# EAGLE design MOD-IO2_Rev_B (EAGLE 6.4)
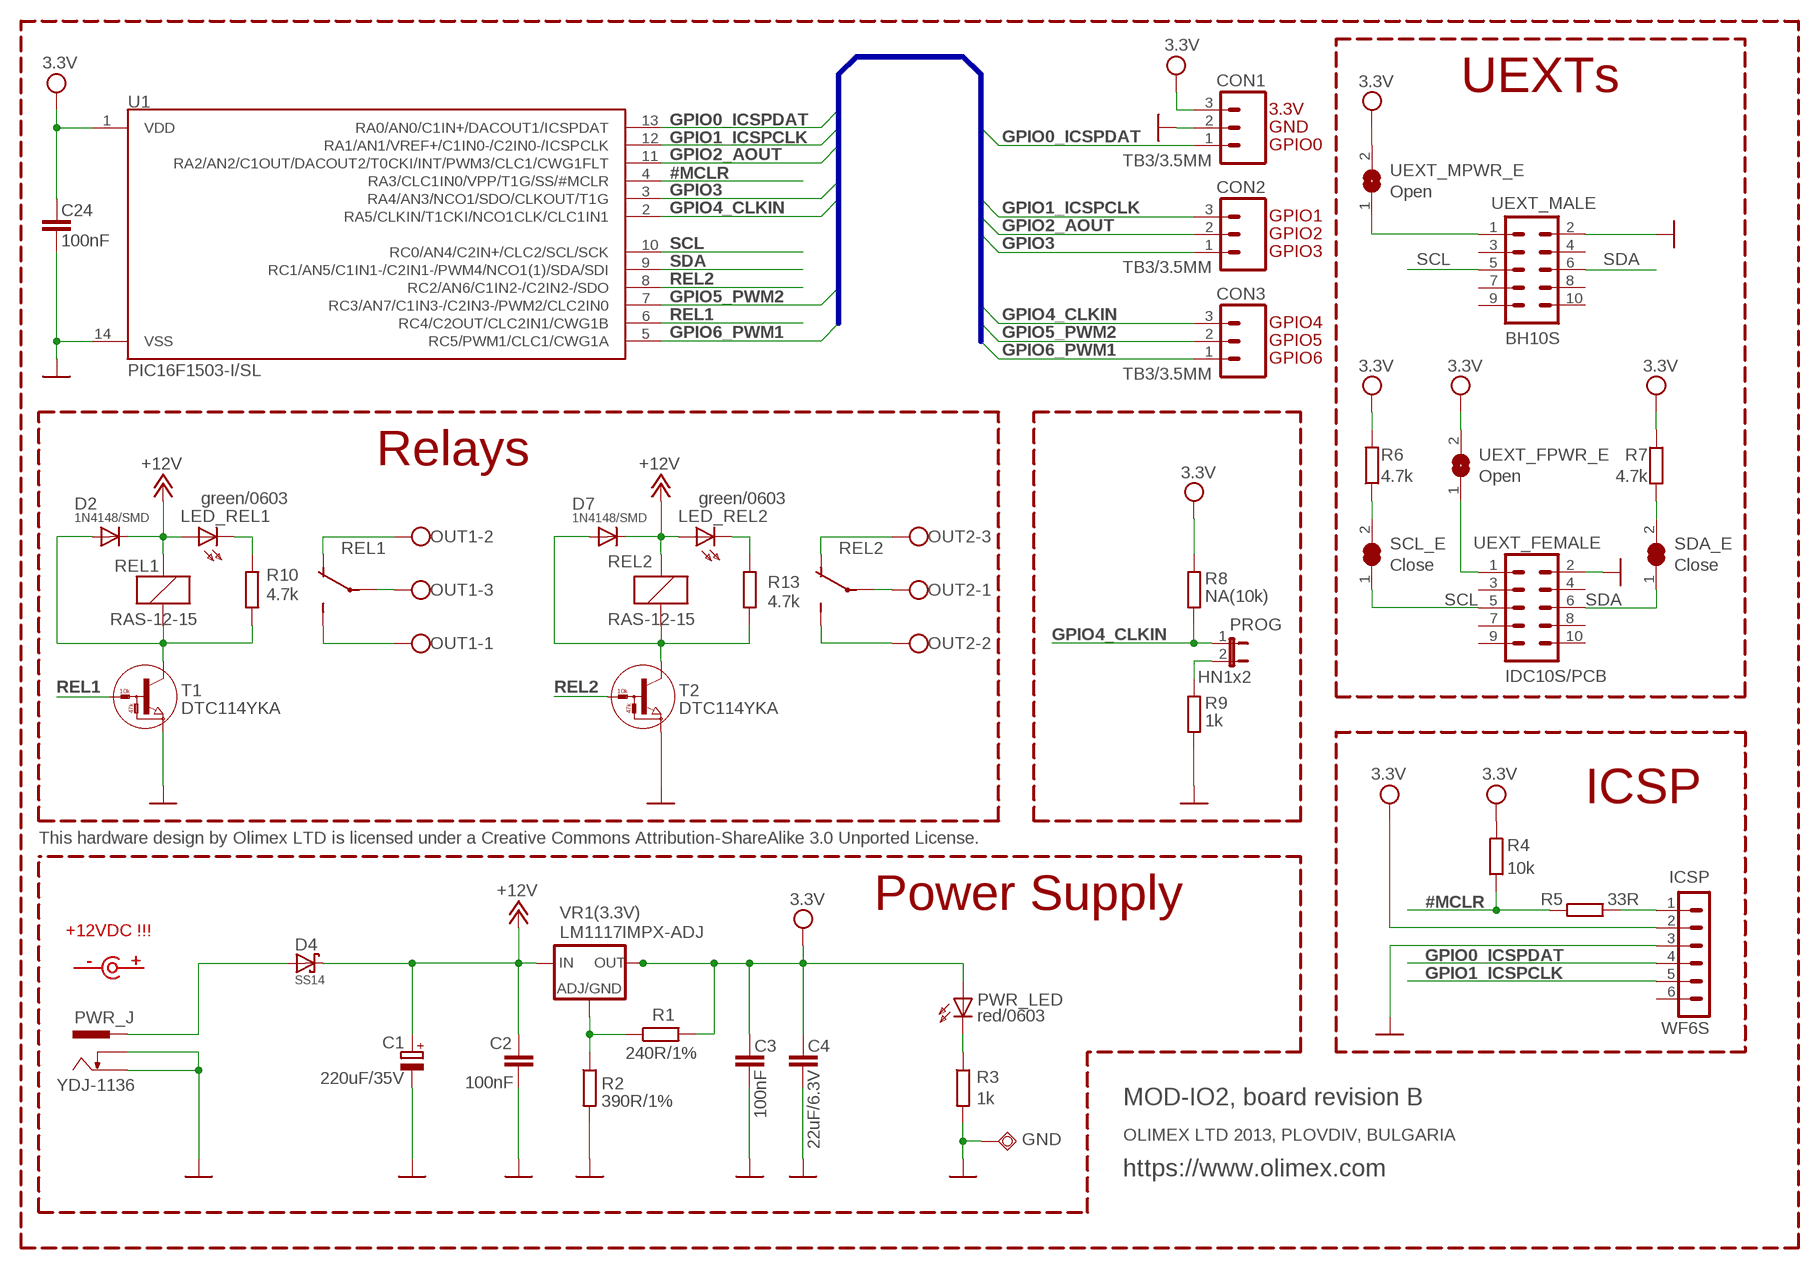
[diagram p0: schematic, sheet 1]

## Parts
C1  220uF/35V  CPOL-EUE3.5-8  [E3,5-8]
C2  100nF  C-EUC0603_5MIL  [C0603_5MIL]
C3  100nF  C-EUC0603_5MIL  [C0603_5MIL]
C4  22uF/6.3V  C-EUC0805_5MIL  [C0805_5MIL]
C24  100nF  C-EUC0603_5MIL  [C0603_5MIL]
CON1  TB3/3.5MM  CON33.5MM  [CON3/3.5MM]
CON2  TB3/3.5MM  CON33.5MM  [CON3/3.5MM]
CON3  TB3/3.5MM  CON33.5MM  [CON3/3.5MM]
D2  1N4148/SMD  DIODE-SOD80C  [SOD80C]
D4  SS14  SCHOTKKY7.62SS2  [MLL-41]
D7  1N4148/SMD  DIODE-SOD80C  [SOD80C]
GND  TESTPAD40/70  [TESTPAD]
ICSP  WF6S  CON6WF6S  [WF6S]
LED_REL1  green/0603  LED0603DWS  [LED-0603]
LED_REL2  green/0603  LED0603DWS  [LED-0603]
OUT1  TB3/5MM  W237-103  [W237-103]
OUT2  TB3/5MM  W237-103  [W237-103]
PROG  HN1x2  JP1E  [JP1]
PWR_J  YDJ-1136  PWR-JAKPWR_JACK_UNI_MILLING  [PWR_JACK_UNI_MILLING]
PWR_LED  red/0603  LED0603DWS  [LED-0603]
R1  240R/1%  R-EU_R0603_5MIL  [R0603_5MIL]
R2  390R/1%  R-EU_R0603_5MIL  [R0603_5MIL]
R3  1k  R-EU_R0603_5MIL  [R0603_5MIL]
R4  10k  R-EU_R0603_5MIL  [R0603_5MIL]
R5  33R  R-EU_R0603_5MIL  [R0603_5MIL]
R6  4.7k  R-EU_R0603_5MIL  [R0603_5MIL]
R7  4.7k  R-EU_R0603_5MIL  [R0603_5MIL]
R8  NA(10k)  R-EU_R0603_5MIL  [R0603_5MIL]
R9  1k  R-EU_R0603_5MIL  [R0603_5MIL]
R10  4.7k  R-EU_R0603_5MIL  [R0603_5MIL]
R13  4.7k  R-EU_R0603_5MIL  [R0603_5MIL]
REL1  RAS-12-15  RELAYH200F  [H200-FAT]
REL2  RAS-12-15  RELAYH200F  [H200-FAT]
SCL_E  Close  SJSJ-CLOSE  [SJ-CLOSE]
SDA_E  Close  SJSJ-CLOSE  [SJ-CLOSE]
T1  DTC114YKA  DIGITAL_TRANSISTORS-NPNDTC114YKA  [SOT-23]
T2  DTC114YKA  DIGITAL_TRANSISTORS-NPNDTC114YKA  [SOT-23]
U1  PIC16F1503-I/SL  PIC16F1503  [SOIC14]
UEXT_FEMALE  IDC10S/PCB  ML10SMD_1  [ML10L_PADS_FEMAIL]
UEXT_FPWR_E  Open  SJ  [SJ]
UEXT_MALE  BH10S  ML10SMD  [ML10_PADS]
UEXT_MPWR_E  Open  SJ  [SJ]
VR1(3.3V)  LM1117IMPX-ADJ  LM1117  [SOT223]

## Nets
#MCLR: R4.2 R5.2 U1.4(RA3/CLC1IN0/VPP/T1G/SS/#MCLR)
+12V: C1.+ C2.2 D2.C D4.K(C) D7.C LED_REL1.A LED_REL2.A REL1.1 REL2.1 VR1(3.3V).3(IN)
ADJ/GND: R1.1 R2.1 VR1(3.3V).1(ADJ/GND)
GND [PWR]: C1.- C2.1 C3.1 C4.1 C24.2 CON1.2 GND.P$1(PP) ICSP.3 PWR_J.- PWR_J.-- R2.2 R3.2 R9.1 T1.2(E) T2.2(E) U1.14(VSS) UEXT_FEMALE.2 UEXT_MALE.2
GPIO0_ICSPDAT: CON1.1 ICSP.4 U1.13(RA0/AN0/C1IN+/DACOUT1/ICSPDAT)
GPIO1_ICSPCLK: CON2.3 ICSP.5 U1.12(RA1/AN1/VREF+/C1IN0-/C2IN0-/ICSPCLK)
GPIO2_AOUT: CON2.2 U1.11(RA2/AN2/C1OUT/DACOUT2/T0CKI/INT/PWM3/CLC1/CWG1FLT)
GPIO3: CON2.1 U1.3(RA4/AN3/NCO1/SDO/CLKOUT/T1G)
GPIO4_CLKIN: CON3.3 PROG.1 R8.1 U1.2(RA5/CLKIN/T1CKI/NCO1CLK/CLC1IN1)
GPIO5_PWM2: CON3.2 U1.7(RC3/AN7/C1IN3-/C2IN3-/PWM2/CLC2IN0)
GPIO6_PWM1: CON3.1 U1.5(RC5/PWM1/CLC1/CWG1A)
N$1 [rel]: OUT1.3 REL1.P(CONTACTS:P)
N$2 [PWR]: UEXT_FEMALE.1 UEXT_FPWR_E.1
N$3 [rel]: OUT2.1 REL2.P(CONTACTS:P)
N$4 [rel]: OUT2.2 REL2.S(CONTACTS:S)
N$5: R7.1 SDA_E.2
N$6: R6.1 SCL_E.2
N$7 [rel]: OUT1.1 REL1.S(CONTACTS:S)
N$9: PROG.2 R9.2
N$12 [PWR]: UEXT_MALE.1 UEXT_MPWR_E.1
N$15: ICSP.1 R5.1
N$29 [rel]: OUT2.3 REL2.O(CONTACTS:O)
N$33: LED_REL1.C R10.2
N$37 [rel]: OUT1.2 REL1.O(CONTACTS:O)
N$40: LED_REL2.C R13.2
N$43 [pwr2]: D7.A R13.1 REL2.2 T2.3(C)
N$44 [pwr2]: D2.A R10.1 REL1.2 T1.3(C)
N$50: D4.A PWR_J.+
N$59: PWR_LED.C R3.1
REL1: T1.1(B) U1.6(RC4/C2OUT/CLC2IN1/CWG1B)
REL2: T2.1(B) U1.8(RC2/AN6/C1IN2-/C2IN2-/SDO)
SCL: SCL_E.1 U1.10(RC0/AN4/C2IN+/CLC2/SCL/SCK) UEXT_FEMALE.5 UEXT_MALE.5
SDA: SDA_E.1 U1.9(RC1/AN5/C1IN1-/C2IN1-/PWM4/NCO1(1)/SDA/SDI) UEXT_FEMALE.6 UEXT_MALE.6
VCC [PWR]: C3.2 C4.2 C24.1 CON1.3 ICSP.2 PWR_LED.A R1.2 R4.1 R6.2 R7.2 R8.2 U1.1(VDD) UEXT_FPWR_E.2 UEXT_MPWR_E.2 VR1(3.3V).2(OUT) VR1(3.3V).4(RAD) ; supply symbol labelled 3.3V
Unconnected: ICSP.6 UEXT_FEMALE.3 UEXT_FEMALE.4 UEXT_FEMALE.7 UEXT_FEMALE.8 UEXT_FEMALE.9 UEXT_FEMALE.10 UEXT_MALE.3 UEXT_MALE.4 UEXT_MALE.7 UEXT_MALE.8 UEXT_MALE.9 UEXT_MALE.10

## Buses
GPIO0_ICSPDAT,GPIO1_ICSPCLK,GPIO2_AOUT,GPIO3,GPIO4_CLKIN,GPIO5_PWM2,GPIO6_PWM1

## Notes on the sheet
- UEXTs
- 3.3V
- GND
- GPIO0
- GPIO1
- GPIO2
- GPIO3
- GPIO4
- GPIO5
- GPIO6
- Relays
- ICSP
- This hardware design by Olimex LTD is licensed under a Creative Commons Attribution-ShareAlike 3.0 Unported License.
- Power Supply
- +12VDC !!!
- - | +
- MOD-IO2, board revision B
- OLIMEX LTD 2013, PLOVDIV, BULGARIA
- https://www.olimex.com

## Library data of the parts
C1 = rcl:CPOL-EU: POLARIZED CAPACITOR, European symbol
C2-C4 C24 = rcl:C-EU: CAPACITOR, European symbol
CON1-CON3 = DOUBLE-SIDE:CON3: CONNECTORS - 3 PINS
D2 D7 = diode:DIODE-: DIODE
D4 = gogo:SCHOTKKY7.62SS
GND = gogo:TESTPAD: drill 40mils, diameter 70mils
ICSP = Penko:CON6: CONNECTORS - 6 PINS
LED_REL1 LED_REL2 PWR_LED = DOUBLE-SIDE:LED
OUT1 OUT2 = con-wago-500:W237-103: WAGO SCREW CLAMP
PROG = jumper:JP1E: JUMPER
PWR_J = gogo:PWR-JAK
R1-R10 R13 = rcl:R-EU_: RESISTOR, European symbol
REL1 REL2 = SINGLE-SIDE:RELAY: RELAY
SCL_E SDA_E UEXT_FPWR_E UEXT_MPWR_E = jumper:SJ: SMD solder JUMPER
T1 T2 = OLIMEX_DISCRET:DIGITAL_TRANSISTORS-NPN: DTC114YKA Digital Transistor - NPN
U1 = OLIMEX_IC:PIC16F1503
UEXT_FEMALE UEXT_MALE = con-harting-ml:ML10: HARTING
VR1(3.3V) = arm:LM1117

## Net classes
1 PWR: width 0.203 mm, drill 0.4 mm, clearance 0.076 mm
2 pwr2: width 0.508 mm
3 rel: width 2.54 mm, clearance 1.905 mm

## Board
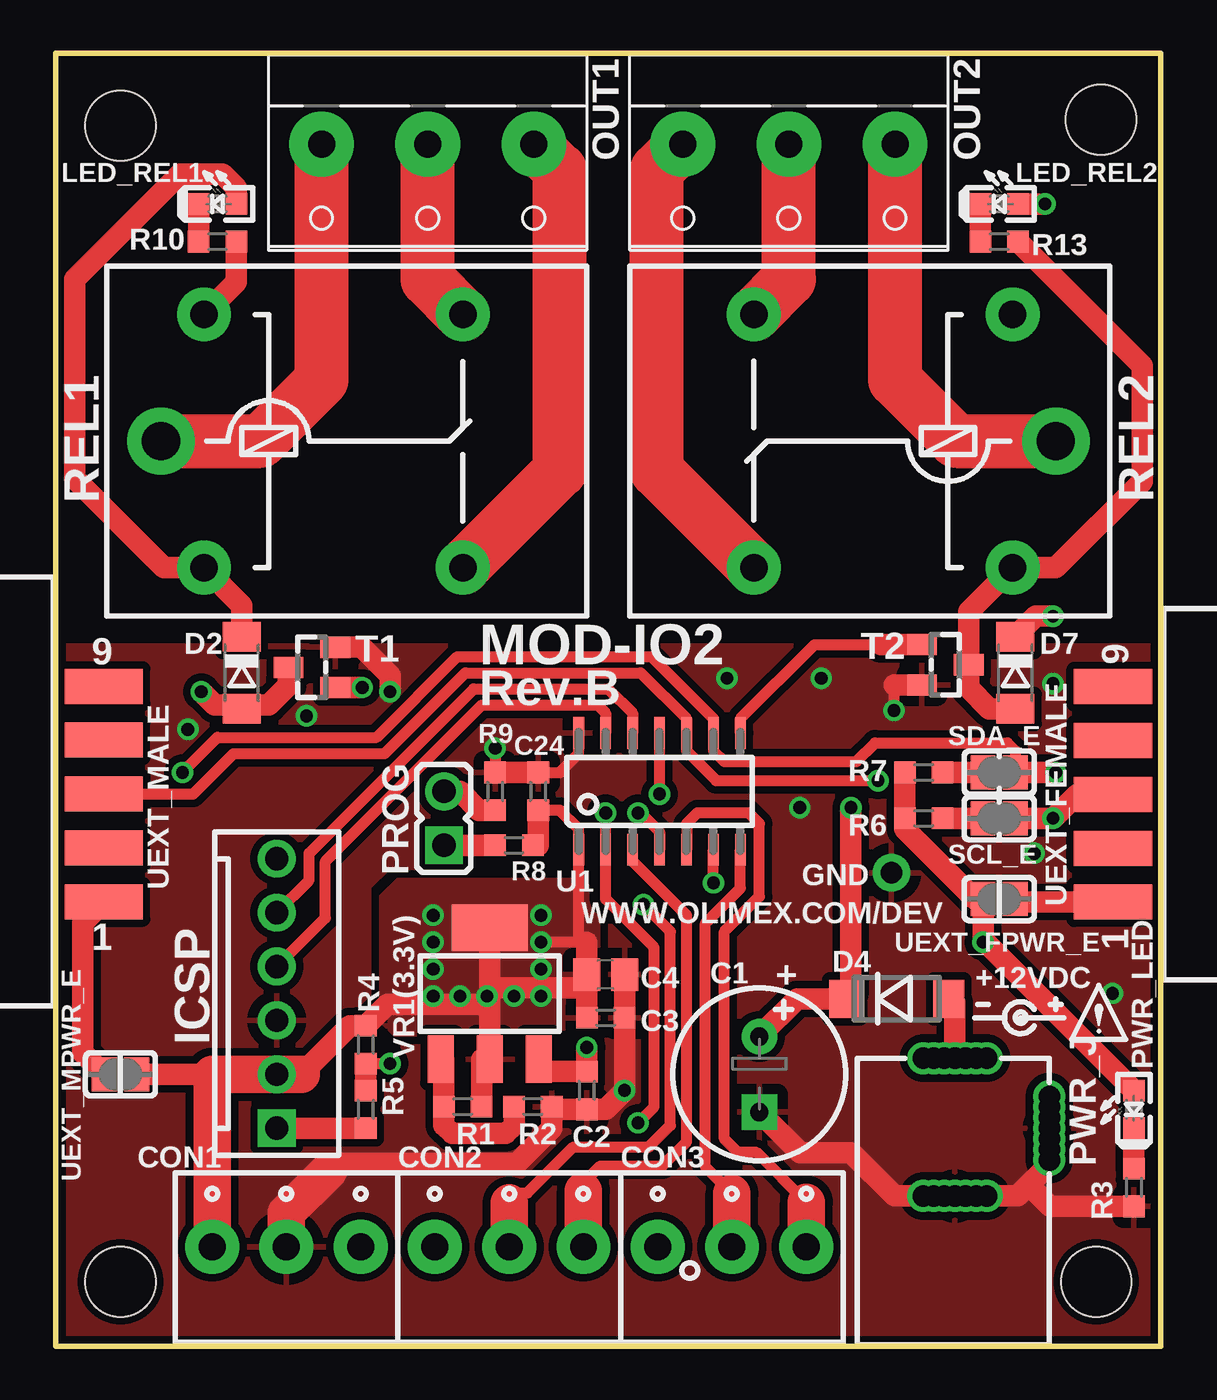
[diagram p1: board, top side]
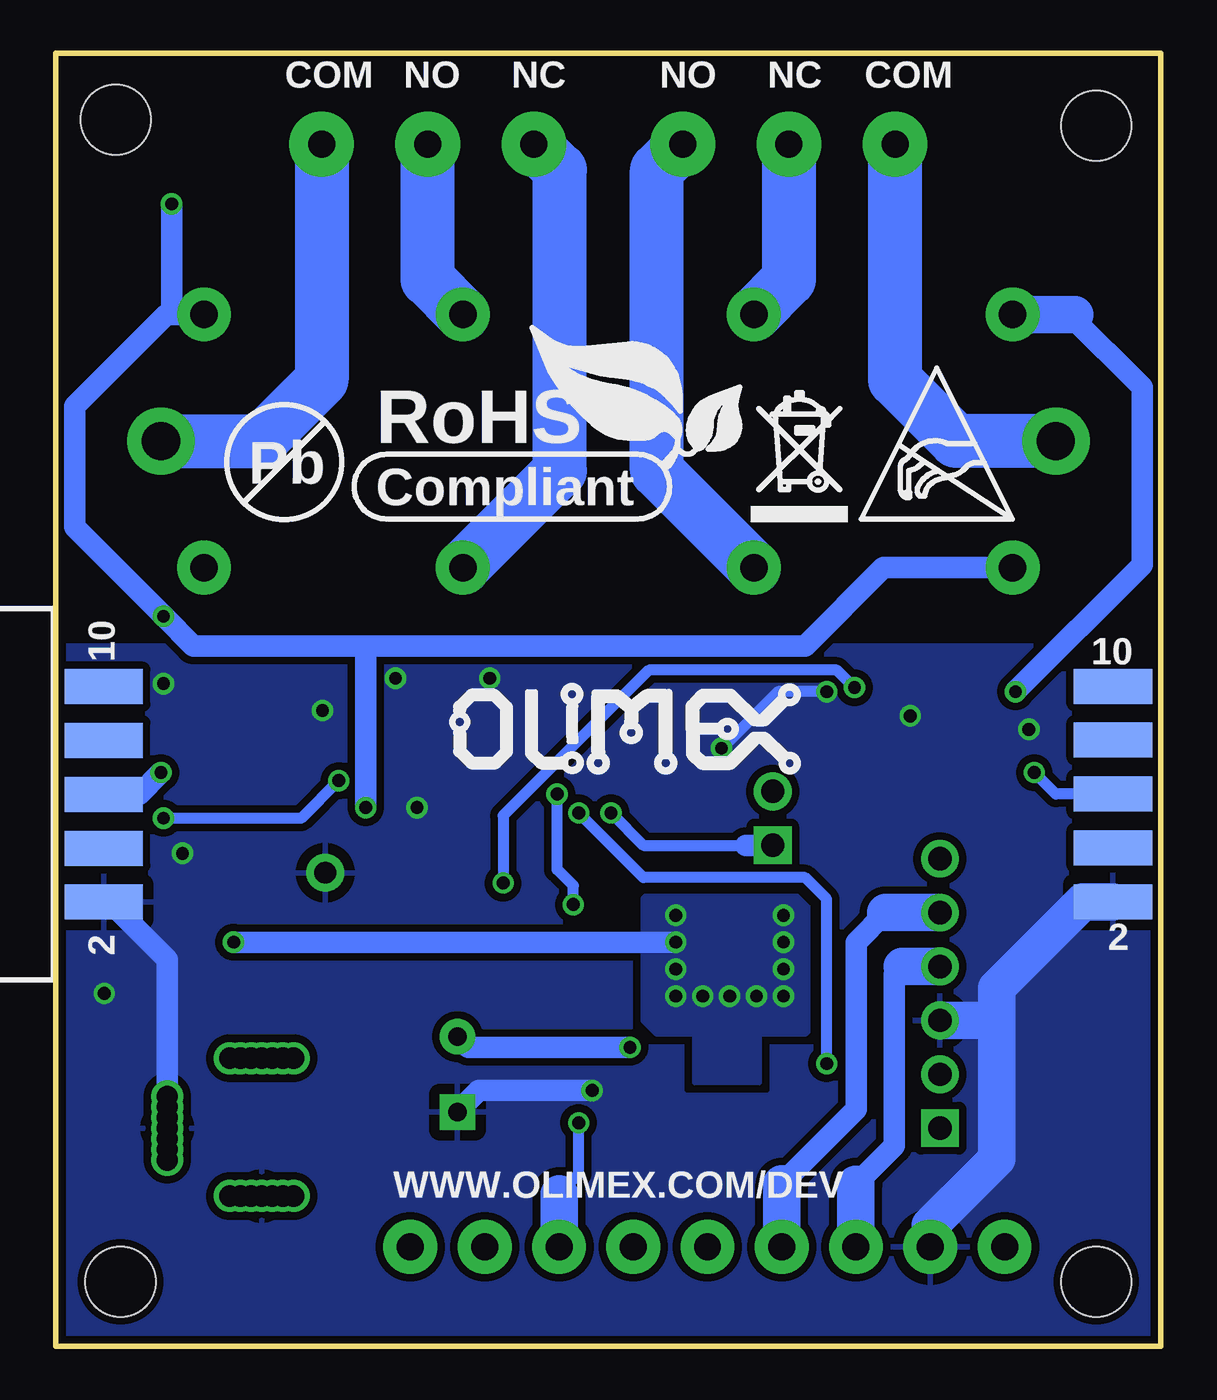
[diagram p2: board, bottom side, seen from below]

Size 52.07 x 60.96 mm. Coordinates in mm from the lower left corner, seen from the top.
Outline: 0,0 52.07,0 52.07,60.96 0,60.96 0,0
Copper layers (1+16): Top 0.035mm / dielectric 1.5mm / Bottom 0.035mm
Design rules "default": minimum track width 10mil, minimum drill 0.6mm, track to track 10mil, track to pad 10mil, pad to pad 10mil, via to via 10mil, smd to smd 1mil, copper to edge 10mil, drill to drill 8mil, minimum pad ring 10mil, minimum via ring 8mil, stop-mask expansion 4mil, vias tented up to drill 25mil, thermal gap 20mil
Holes 3.3 mm at 3.05,57.53 3.05,3.05 49.02,3.05 49.25,57.82

### Footprints (pad centres in the part's own frame; a part is rotated, then mirrored left to right if it is on the bottom)
E3,5-8 = drill 0.864 pad 1.676: + -1.778,0 | drill 0.864 pad 1.676 square: - 1.778,0
C0603_5MIL = smd 1.016 x 1.016: 1 -0.889,0; 2 0.889,0
C0805_5MIL = smd 1.27 x 1.524: 1 -0.889,0; 2 0.889,0
CON3/3.5MM = drill 1.27 pad 2.54: 1 -1.75,-0.5; 2 1.75,-0.5; 3 5.25,-0.5
SOD80C = smd 1.4 x 1.8: A 1.7,0; C -1.7,0
MLL-41 = smd 1.45 x 1.8: A 2.445,0; K -2.445,0
TESTPAD = drill 1.016 pad 1.778: P$1 0,0
WF6S = drill 1.1 pad 1.778 square: 1 -6.35,0 | drill 1.1 pad 1.778: 2 -3.81,0; 3 -1.27,0; 4 1.27,0; 5 3.81,0; 6 6.35,0
LED-0603 = smd 1.016 x 1.016: A 0.889,0; C -0.889,0
W237-103 = drill 1.27 pad 3.048: 1 -5,-1.29; 2 0,-1.29; 3 5,-1.29
JP1 = drill 1.1 pad 1.778 square: 1 0,-1.27 | drill 1.1 pad 1.778: 2 0,1.27
PWR_JACK_UNI_MILLING = drill 1: + 0,4.75; +1 0,5.25; +2 0,5.75; +3 0,6.25; +4 0,4.25; +5 0,3.75; +6 0,3.25; - -6.5,4.75; -1 -6.5,5.25; -2 -6.5,5.75; -3 -6.5,4.25; -4 -6.5,3.75; -5 -6.5,6.25; -6 -6.5,3.25; -- -3.3,0.3; --1 -3.8,0.3; --2 -4.3,0.3; --3 -4.8,0.3; --4 -2.8,0.3; --5 -2.3,0.3; --6 -1.8,0.3
R0603_5MIL = smd 1.016 x 1.016: 1 -0.889,0; 2 0.889,0
H200-FAT = drill 1.295 pad 2.54: 1 -7.493,-5.969; 2 -7.493,5.969; O 4.699,5.969; S 4.699,-5.969 | drill 1.803 pad 3.175: P -9.525,0
SJ-CLOSE = smd 1.168 x 1.6: 1 -0.762,0; 2 0.762,0
SOT-23 = smd 1 x 1.4: 1 -0.95,-1.1; 2 0.95,-1.1; 3 0,1.1
SOIC14 = smd 0.5 x 1.5: 1 -3.81,-2.75; 2 -2.54,-2.75; 3 -1.27,-2.75; 4 0,-2.75; 5 1.27,-2.75; 6 2.54,-2.75; 7 3.81,-2.75; 8 3.81,2.75; 9 2.54,2.75; 10 1.27,2.75; 11 0,2.75; 12 -1.27,2.75; 13 -2.54,2.75; 14 -3.81,2.75
ML10L_PADS_FEMAIL = smd 1.651 x 3.683 bottom: 1 -5.093,-3.404; 3 -2.553,-3.404; 5 -0.013,-3.404; 7 2.527,-3.404; 9 5.067,-3.404 | smd 1.651 x 3.683: 2 -5.093,-3.404; 4 -2.553,-3.404; 6 -0.013,-3.404; 8 2.527,-3.404; 10 5.067,-3.404
SJ = smd 1.168 x 1.6: 1 -0.762,0; 2 0.762,0
ML10_PADS = smd 1.651 x 3.683: 1 -5.08,-0.229; 3 -2.54,-0.229; 5 0,-0.229; 7 2.54,-0.229; 9 5.08,-0.229 | smd 1.651 x 3.683 bottom: 2 -5.08,-0.229; 4 -2.54,-0.229; 6 0,-0.229; 8 2.54,-0.229; 10 5.08,-0.229
SOT223 = smd 1.219 x 2.235: 1 -2.311,-3.099; 2 0,-3.099; 3 2.311,-3.099 | smd 3.6 x 2.2: 4 0,3.099

### Placement (x,y rotation side)
C1  33.15,12.83 270 top
C2  25.02,12.06 90 top
C3  25.91,15.49 180 top
C4  25.91,17.53 180 top
C24  22.73,26.16 90 top
CON1  12.62,4.19 180 top
CON2  23.11,4.19 180 top
CON3  33.61,4.19 180 top
D2  8.76,31.75 270 top
D4  39.62,16.38 0 top
D7  45.21,31.75 270 top
GND  39.37,22.33 0 top
ICSP  10.41,16.64 90 top
LED_REL1  7.62,53.85 0 top
LED_REL2  44.45,53.85 0 top
OUT1  17.53,55.37 180 top
OUT2  34.54,55.37 180 top
PROG  18.29,24.89 0 top
PWR_J  47.12,13.59 90 top
PWR_LED  50.8,11.18 90 top
R1  19.18,11.3 0 top
R2  22.48,11.3 0 top
R3  50.8,7.49 270 top
R4  14.61,14.22 270 top
R5  14.61,11.18 90 top
R6  40.89,24.89 180 top
R7  40.89,27.05 180 top
R8  21.59,23.62 0 top
R9  20.7,26.16 270 top
R10  7.62,52.07 180 top
R13  44.45,52.07 180 top
REL1  14.48,42.67 0 top
REL2  37.59,42.67 180 top
SCL_E  44.45,24.89 180 top
SDA_E  44.45,27.05 180 top
T1  12.06,32 90 top
T2  41.91,32.13 270 top
U1  28.45,26.16 0 top
U$1  [RECYCLE_BIN1/8]  19.32,38.86 0 bottom
U$3  [ESD_SYMBOL]  14.11,38.99 0 bottom
U$4  [PB]  41.3,41.69 0 bottom
U$5  [ROHS]  36.99,39.64 0 bottom
U$6  [OLIMEX1_V]  15.82,26.84 0 bottom
U$9  [ATTENTION_SMALL]  47.88,14.48 0 top
UEXT_FEMALE  53.21,26.04 90 bottom
UEXT_FPWR_E  44.45,21.08 180 top
UEXT_MALE  2.03,26.04 90 top
UEXT_MPWR_E  3.05,12.83 0 top
VR1(3.3V)  20.45,16.64 0 top

### Tracks (layer width: path | path; a pad name or v marks a point on that pad's centre or on a via)
#MCLR  (via drill 0.6)
  Top 0.508: U1.4 28.45,24.26 27.56,25.15 v27.43,25.15 | R4.2 v15.75,13.34
  Top 1.016: R5.2 R4.2
  Bottom 0.508: v27.43,25.15 24.38,22.1 16.76,22.1 15.75,21.08 v15.75,13.34
+12V  (via drill 0.6)
  Top 1.016: VR1(3.3V).3 22.76,12.95 C2.2 v25.02,14.1 | v46.61,53.85 LED_REL2.A | D2.C 8.76,34.92 REL1.1 5.08,36.7 0.89,40.89 0.89,50.29 5.84,55.24 7.87,55.24 8.51,54.61 LED_REL1.A | D7.C 46.18,34.42 v46.99,34.42 | C1.+ 34.92,16.38 D4.K 37.47,16.67 v37.47,25.4
  Bottom 1.016: v25.02,14.1 32.64,14.1 C1.+ | 46.61,48.64 v46.61,53.85 | 46.61,48.64 REL2.1 | REL1.1 13.08,36.7 16.76,33.02 37.47,33.02 | 37.47,33.02 45.59,33.02 v46.99,34.42 51.18,38.61 51.18,44.32 46.86,48.64 46.61,48.64 | v37.47,25.4 37.47,33.02
ADJ/GND
  Top 1.016: VR1(3.3V).1 18.29,13.54 R1.1 18.29,10.41 18.67,10.03 21.21,10.03 21.59,10.41 R2.1
GND  (via drill 0.6)
  Top 0.508: U1.14 24.64,27.94 23.75,27.05 C24.2 R9.1 v20.7,28.19 | v39.5,29.97 39.5,31.18
  Top 1.016: 39.5,31.18 T2.2 | 23.37,11.18 C2.1 25.91,11.18 v26.8,12.06 C3.1 C4.1 | PWR_J.-- 46.82,8.59 45.85,7.62 | 45.85,7.62 45.32,7.09 PWR_J.- 39.52,7.09 37.49,9.12 35.08,9.12 C1.- | R3.2 46.86,6.6 45.85,7.62 | 23.37,11.18 23.37,10.29 21.72,8.64 13.21,8.64 12.83,8.26 | 23.37,11.18 R2.2 | T1.2 14.42,32.95 15.75,31.62 v15.75,30.86 | R9.1 C24.2
  Top 1.778: CON1.2 10.87,6.3 12.83,8.26
  Bottom 0.508: v15.75,30.86 18.03,30.86 v20.7,28.19
  Bottom 1.016: v26.8,12.06 32.13,12.06 C1.- | UEXT_FEMALE.2 49.52,20.94 46.82,18.24 PWR_J.--
  Bottom 1.778: 7.75,15.37 ICSP.3 | 7.75,15.37 7.75,16.89 3.68,20.95 UEXT_MALE.2 | CON1.2 10.87,5.71 7.75,8.84 7.75,15.37
  other vias: 11.81,29.72 31.62,31.5 49.78,16.64 46.1,23.24 46.99,31.24 6.22,29.08 36.07,31.5 35.05,25.4
  pour Bottom (isolate 0.356, rank 2): 57.15,-5.08 -5.08,-5.08 -5.08,33.02 57.15,33.02
  pour Top (isolate 0.356, rank 2): 54.61,-2.54 -2.54,-2.54 -2.54,33.02 54.61,33.02
GPIO0_ICSPDAT
  Top 0.508: U1.13 25.91,29.84 25.53,30.23 20.07,30.23 12.7,22.86 12.7,20.19 ICSP.4
  Bottom 1.016: 14.37,7.65 12.57,9.44 12.57,17.53 12.19,17.91
  Bottom 1.778: CON1.1 14.37,7.65 | 12.19,17.91 ICSP.4
GPIO1_ICSPCLK
  Top 0.508: U1.12 27.18,29.84 26.04,30.99 19.68,30.99 11.94,23.24 11.94,21.97 ICSP.5
  Bottom 1.016: 17.86,7.66 14.35,11.18 14.35,19.05 12.95,20.45
  Bottom 1.778: 12.95,20.45 ICSP.5 | CON2.3 17.86,7.66
GPIO2_AOUT  (via drill 0.6)
  Top 0.508: v27.69,20.83 28.96,19.56 28.96,10.41 27.94,9.4 24.38,9.4 22.23,7.24 21.84,7.24 21.36,6.76 | v28.45,26.04 U1.11
  Top 1.778: CON2.2 21.36,6.76
  Bottom 0.508: v27.69,20.83 27.69,21.72 28.45,22.48 v28.45,26.04
GPIO3
  Top 0.508: U1.3 27.18,22.86 29.72,20.32 29.72,9.65 28.57,8.51 25.65,8.51 25.02,7.87 25.02,7.49 24.86,7.34
  Top 1.778: CON2.1 24.86,7.34
GPIO4_CLKIN  (via drill 0.6)
  Top 0.508: v27.43,10.54 28.19,11.3 28.19,18.8 25.91,21.08 U1.2 v25.91,25.15
  Top 1.016: PROG.1 R8.1
  Bottom 0.508: 28.36,7.2 27.43,8.13 v27.43,10.54 | v25.91,25.15 24.38,23.62 19.56,23.62
  Bottom 1.016: 19.56,23.62 PROG.1
  Bottom 1.778: CON3.3 28.36,7.2
GPIO5_PWM2
  Top 0.508: U1.7 32.26,21.59 30.61,19.94 30.61,8.46 31.86,7.21
  Top 1.778: CON3.2 31.86,7.21
GPIO6_PWM1
  Top 0.508: 35.36,6.8 33.02,9.14 32.13,9.14 31.5,9.78 31.5,19.56 33.15,21.21 33.15,24.64 32.64,25.15 30.23,25.15 29.72,24.64 U1.5
  Top 1.778: CON3.1 35.36,6.8
N$1
  Top 2.54: OUT1.3 12.53,45.55 9.65,42.67 REL1.P
  Bottom 2.54: OUT1.3 12.53,45.55 9.65,42.67 REL1.P
N$2
  Top 1.016: UEXT_FEMALE.1 45.35,20.94 UEXT_FPWR_E.1
N$3
  Top 2.54: OUT2.1 39.54,45.55 42.42,42.67 REL2.P
  Bottom 2.54: OUT2.1 39.54,45.55 42.42,42.67 REL2.P
N$4
  Top 2.54: OUT2.2 34.54,50.29 REL2.S
  Bottom 2.54: OUT2.2 34.54,50.29 REL2.S
N$5
  Top 1.016: R7.1 SDA_E.2
N$6
  Top 1.016: R6.1 SCL_E.2
N$7
  Top 2.54: OUT1.1 23.75,55.44 23.75,41.27 REL1.S
  Bottom 2.54: OUT1.1 23.75,55.44 23.75,41.27 REL1.S
N$9
  Top 1.016: R9.2 19.94,25.27 19.05,26.16 PROG.2
N$12
  Top 1.016: UEXT_MALE.1 1.27,19.96 1.27,13.84 UEXT_MPWR_E.1
N$15
  Top 1.016: ICSP.1 R5.1
N$29
  Top 2.54: OUT2.3 28.32,55.44 28.32,41.27 REL2.O
  Bottom 2.54: OUT2.3 28.32,55.44 28.32,41.27 REL2.O
N$33
  Top 1.016: R10.2 LED_REL1.C
N$37
  Top 2.54: OUT1.2 17.53,50.29 REL1.O
  Bottom 2.54: OUT1.2 17.53,50.29 REL1.O
N$40
  Top 1.016: R13.2 LED_REL2.C
N$43
  Top 1.016: D7.A 43.99,30.05 43.01,31.03 T2.3 43.01,34.63 REL2.2 47.12,36.7 51.18,40.77 51.18,46.23 R13.1
N$44  (via drill 0.6)
  Top 1.016: R10.1 8.51,50.16 REL1.2 | T1.3 10.96,31.16 10.03,30.23 8.76,30.23 D2.A 8.59,30.23 7.49,30.23 v6.86,30.86
  Bottom 1.016: v6.86,30.86 0.89,36.83 0.89,45.21 4.32,48.64
  Bottom 1.778: 4.06,48.64 4.32,48.64 REL1.2
N$50
  Top 1.016: D4.A 42.19,16.38 42.37,16.2 PWR_J.+
N$59
  Top 1.016: R3.1 PWR_LED.C
REL1  (via drill 0.6)
  Top 0.508: v30.99,21.84 U1.6
  Top 1.016: T1.1 v14.44,31.05
  Bottom 0.508: v14.44,31.05 15.27,31.88 24.13,31.88 30.99,25.02 v30.99,21.84
REL2
  Top 0.508: U1.8 32.26,29.59 35.75,33.08 38.86,33.08
  Top 1.016: 38.86,33.08 T2.1
SCL  (via drill 0.6)
  Top 0.508: UEXT_MALE.5 6.48,26.04 8.38,27.94 15.49,27.94 19.3,31.75 27.56,31.75 29.72,29.59 U1.10 29.72,28.07 31.11,26.67 v38.73,26.67
  Top 1.016: UEXT_FEMALE.5 48.12,26.02 v46.99,24.89 SCL_E.1
  Bottom 0.508: v38.73,26.67 40.51,24.89 v46.99,24.89
SDA  (via drill 0.6)
  Top 0.508: v5.97,27.05 7.62,28.7 15.11,28.7 18.92,32.51 28.07,32.51 30.99,29.59 U1.9 30.99,28.07 31.5,27.56 37.72,27.56 38.61,28.45 44.83,28.45 45.21,28.07 SDA_E.1
  Top 1.016: SDA_E.1 v47.12,27.05
  Bottom 0.508: UEXT_MALE.6 4.95,26.04 v5.97,27.05
  Bottom 1.016: UEXT_FEMALE.6 48.15,26.02 v47.12,27.05
VCC  (via drill 0.6)
  Top 0.508: C24.1 23.75,25.27 24.64,24.38 U1.1 24.64,19.05 | 25.02,19.05 24.64,19.05 | 24.64,19.05 v22.86,19.05
  Top 1.016: R1.2 20.07,13.54 VR1(3.3V).2 20.45,16.13 | 25.02,19.05 C4.2 25.02,16.89 | 25.02,16.89 C3.2 | 20.45,16.89 25.02,16.89 | PWR_LED.A 43.81,19.05 v43.69,19.05 UEXT_FPWR_E.2 43.31,21.08 40.01,24.38 R6.2 R7.2 | 11.56,12.83 13.84,15.11 R4.1 15.62,16.13 20.45,16.13 | 20.45,16.13 20.45,16.89 | 20.45,16.89 VR1(3.3V).4 | 7.37,12.83 UEXT_MPWR_E.2 | R8.2 22.73,23.62 C24.1
  Top 1.778: 11.56,12.83 ICSP.2 7.37,12.83 CON1.3
  Bottom 1.016: v22.86,19.05 v43.69,19.05
  other vias: 17.78,20.32 17.78,19.05 17.78,17.78 17.78,16.51 19.05,16.51 20.32,16.51 21.59,16.51 22.86,16.51 22.86,17.78 22.86,20.32
  pour Top (isolate 0.508): 18.92,12.45 21.97,12.45 21.97,14.73 24.89,14.73 25.53,15.37 25.53,21.21 24.77,21.97 16.13,21.97 15.37,21.21 15.37,15.37 16,14.73 18.92,14.73
  pour Bottom (isolate 0.508): 16.13,15.37 16.76,14.73 18.92,14.73 18.92,12.45 21.97,12.45 21.97,14.73 23.75,14.73 24.38,15.37 24.38,21.08 23.75,21.72 16.89,21.72 16.13,20.95

### Text on the board
tPlace: 9 | +
bPlace: 10
tNames: MOD-IO2 | Rev.B | WWW.OLIMEX.COM/DEV | +12VDC
bNames: COM | NC | NO | NC | NO | COM | WWW.OLIMEX.COM/DEV
bStop: 3.3V | GPIO0 | GPIO2 | GPIO4 | GPIO6 | GND | GPIO1 | GPIO3 | GPIO5